# Altium schematic sheet PCA4595A_4-ch_I2C_Switch.SchDoc: PCA9545A 4-ch I2C Switch
size A4
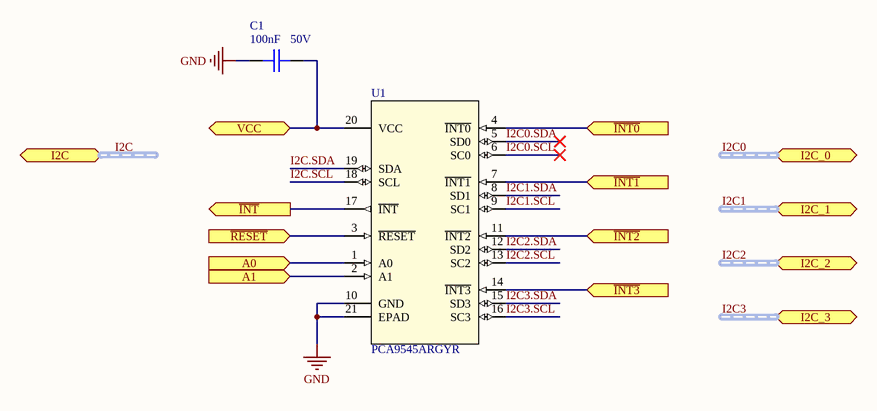
[diagram p0: PCA4595A_4-ch_I2C_Switch.SchDoc]

## Parts
C1  Capacitance: 100nF  Voltage: 50V  [C0402]  (hidden comment: CGA2B3X7R1H104K050BB)
U1  PCA9545ARGYR  [RGY20_3P05X2P05]

## Ports
A0 (in), A1 (in), I2C (harness I2C), I2C_0 (harness I2C), I2C_1 (harness I2C), I2C_2 (harness I2C), I2C_3 (harness I2C), VCC, ~{INT0} (in), ~{INT1} (in), ~{INT2} (in), ~{INT3} (in), ~{INT} (out), ~{RESET} (in)

## Nets
GND: C1.2 U1.10(GND) U1.21(EPAD)
~{INT}: U1.17(~{INT}) ; port ~{INT}
~{INT0}: U1.4(~{INT0}) ; port ~{INT0}
~{INT1}: U1.7(~{INT1}) ; port ~{INT1}
~{INT2}: U1.11(~{INT2}) ; port ~{INT2}
~{INT3}: U1.14(~{INT3}) ; port ~{INT3}
~{RESET}: U1.3(~{RESET}) ; port ~{RESET}
A0: U1.1(A0) ; port A0
A1: U1.2(A1) ; port A1
I2C0.SCL: U1.6(SC0)
I2C0.SDA: U1.5(SD0)
I2C1.SCL: U1.9(SC1)
I2C1.SDA: U1.8(SD1)
I2C2.SCL: U1.13(SC2)
I2C2.SDA: U1.12(SD2)
I2C3.SCL: U1.16(SC3)
I2C3.SDA: U1.15(SD3)
I2C.SCL: U1.18(SCL)
I2C.SDA: U1.19(SDA)
VCC: C1.1 U1.20(VCC) ; port VCC

## Buses and harness runs
harness I2C0 = port I2C_0
harness I2C1 = port I2C_1
harness I2C2 = port I2C_2
harness I2C3 = port I2C_3
harness I2C = port I2C

## Notes on the sheet
- Title
- Size:
- Date:
- A4
- Number:
- Time:
- Revision:
- Sheet
- of
- File:

## Library data of the parts
C1 = CAP CER 0.1UF 50V X7R 0402: 0.1µF ±10% 50V Ceramic Capacitor X7R 0402 (1005 Metric); Manufacturer: TDK; Manufacturer Part Number: CGA2B3X7R1H104K050BB; Supplier 1: Digi-Key; Stock 1: 2925303; Pricing 1: 1=0.17, 10=0.118, 50=0.0668, 100=0.0553, 500=0.0388, 1000=0.0321, 2500=0.0299, 5000=0.0273 (USD); Mount: Surface Mount; Case Code (Metric): 1005; Case Code (Imperial): 0402; Min Operating Temperature: -55°C; Max Operating Temperature: 125°C; Tolerance: 10%; Dielectric: X7R; Voltage Rating: 50V; Voltage Rating (DC): 50V; Packaging: Tape and Reel; Package Quantity: 1; Termination: SMD/SMT; Composition: Ceramic; Length: 1mm; Height: 0.5mm; Width: 0.02inch; Thickness: 0.022inch; Depth: 0.5mm; REACH SVHC: No SVHC; Lead Free: Lead Free; ComponentLink1URL: http://product.tdk.com/capacitor/mlcc/en/documents/mlccspec_automotive_general_midvoltage_en.pdf?src-supplier=Future+Electronics; ComponentLink1Description: http://product.tdk.com/capacitor/mlcc/en/documents/mlccspec_automotive_general_midvoltage_en.pdf?src-supplier=Future+Electronics; ComponentLink2URL: http://www.farnell.com/datasheets/1807242.pdf?src-supplier=Element14; ComponentLink2Description: http://www.farnell.com/datasheets/1807242.pdf?src-supplier=Element14; ComponentLink3URL: http://www.mouser.com/ds/2/400/lcc_automotive_general_en-843974.pdf?src-supplier=Mouser; ComponentLink3Description: http://www.mouser.com/ds/2/400/lcc_automotive_general_en-843974.pdf?src-supplier=Mouser; ComponentLink4URL: http://www.farnell.com/datasheets/1936565.pdf?src-supplier=Element14; ComponentLink4Description: http://www.farnell.com/datasheets/1936565.pdf?src-supplier=Element14; ComponentLink5URL: http://www.farnell.com/datasheets/1735392.pdf?src-supplier=Element14; ComponentLink5Description: http://www.farnell.com/datasheets/1735392.pdf?src-supplier=Element14; Supplier Part Number 1: 445-6899-1-ND; Case/Package: 0402; Weight: 2.3E-05oz; Ratings: AEC-Q200
U1 = IC PCA9545A I2C SW 4CH W/RESET 20VQFN: 4-Channel I2C And SMBus Multiplexer With Interrupt Logic And Reset Functions; Manufacturer: Texas Instruments; Max Supply Voltage: 5.5V; Min Supply Voltage: 2.3V; Propagation Delay: 1ns; Number of Channels: 4; Number of Outputs: 1; Bandwidth: 400kHz; Max Power Dissipation: 400mW; On-State Resistance: 45R; Operating Supply Current: 8uA; Throw Configuration: 4PST; Supplier 1: Digi-Key; Manufacturer Part Number: PCA9545ARGYR; Stock 1: 3156; Pricing 1: 1=1.95, 10=1.749, 25=1.65, 100=1.32, 250=1.155, 500=1.122, 1000=0.891 (USD); Number of Pins: 20; Min Operating Temperature: -40°C; Max Operating Temperature: 85°C; Packaging: Tape and Reel; Package Quantity: 1; Logic Function: Multiplexer; Number of Inputs: 4; Radiation Hardening: No; Lead Free: Lead Free; ComponentLink1URL: http://www.ti.com/lit/ds/symlink/pca9545a.pdf?src-supplier=Digi-Key; ComponentLink1Description: http://www.ti.com/lit/ds/symlink/pca9545a.pdf?src-supplier=Digi-Key; ComponentLink2URL: http://www.ti.com/general/docs/lit/getliterature.tsp?genericPartNumber=PCA9545A&&fileType=pdf&src-supplier=Avnet; ComponentLink2Description: http://www.ti.com/general/docs/lit/getliterature.tsp?genericPartNumber=PCA9545A&&fileType=pdf&src-supplier=Avnet; Supplier Part Number 1: 296-20964-1-ND; Case/Package: VQFN EP; Weight: 0.001517oz; Power Dissipation: 400mW; Max Frequency: 400kHz; Number of Circuits: 4; ComponentLink3URL: https://www.verical.com/server-webapp/html/getDatasheet?partID=164589&src-supplier=Verical; ComponentLink3Description: https://www.verical.com/server-webapp/html/getDatasheet?partID=164589&src-supplier=Verical; ComponentLink4URL: http://www.produktinfo.conrad.com/datenblaetter/1100000-1199999/001188020-da-01-en-IC_I2C_SMBUS_SW_PCA9545ARGYR_VQFN_20_TID.pdf?src-supplier=Conrad; ComponentLink4Description: http://www.produktinfo.conrad.com/datenblaetter/1100000-1199999/001188020-da-01-en-IC_I2C_SMBUS_SW_PCA9545ARGYR_VQFN_20_TID.pdf?src-supplier=Conrad; Mount: Surface Mount